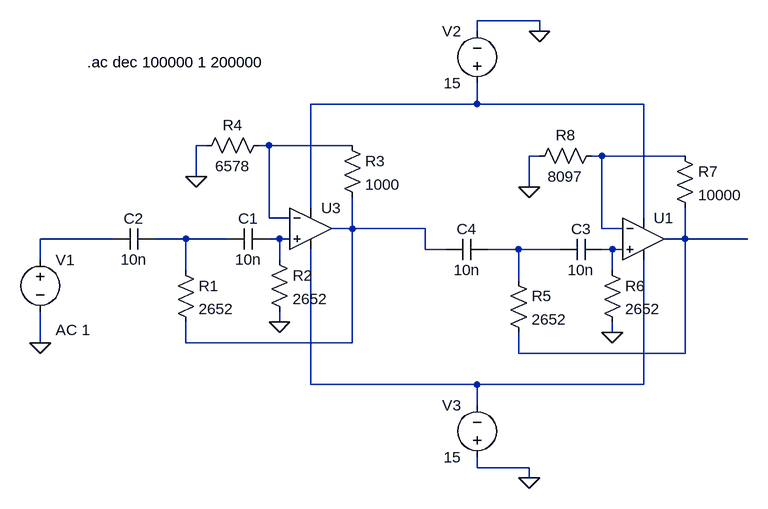
[diagram p0: schematic teste.asc]
teste.asc, the LTspice schematic file:
Version 4
SHEET 1 880 744
WIRE 128 -144 32 -144
WIRE 32 -128 32 -144
WIRE 128 -128 128 -144
WIRE 32 -16 32 -48
WIRE 32 -16 -224 -16
WIRE 288 -16 32 -16
WIRE -384 48 -400 48
WIRE -288 48 -304 48
WIRE -160 48 -288 48
WIRE 128 64 112 64
WIRE 224 64 208 64
WIRE 352 64 224 64
WIRE -400 96 -400 48
WIRE 112 112 112 64
WIRE -224 144 -224 -16
WIRE -288 160 -288 48
WIRE -256 160 -288 160
WIRE 288 160 288 -16
WIRE -160 176 -160 128
WIRE -160 176 -192 176
WIRE -48 176 -160 176
WIRE 224 176 224 64
WIRE 256 176 224 176
WIRE -528 192 -640 192
WIRE -416 192 -464 192
WIRE -352 192 -416 192
WIRE -272 192 -288 192
WIRE -256 192 -272 192
WIRE 352 192 352 144
WIRE 352 192 320 192
WIRE 448 192 352 192
WIRE -48 208 -48 176
WIRE -16 208 -48 208
WIRE 96 208 48 208
WIRE 160 208 96 208
WIRE 240 208 224 208
WIRE 256 208 240 208
WIRE -640 224 -640 192
WIRE -272 224 -272 192
WIRE -416 240 -416 192
WIRE 240 240 240 208
WIRE 96 256 96 208
WIRE -272 320 -272 304
WIRE 240 336 240 320
WIRE -640 352 -640 304
WIRE -416 352 -416 320
WIRE -160 352 -160 176
WIRE -160 352 -416 352
WIRE 96 368 96 336
WIRE 352 368 352 192
WIRE 352 368 96 368
WIRE -224 416 -224 208
WIRE 32 416 -224 416
WIRE 288 416 288 224
WIRE 288 416 32 416
WIRE 32 448 32 416
WIRE 32 544 32 528
WIRE 112 544 32 544
WIRE 112 560 112 544
FLAG -272 320 0
FLAG -400 96 0
FLAG 128 -128 0
FLAG 112 560 0
FLAG 240 336 0
FLAG 112 112 0
FLAG -640 352 0
SYMBOL Opamps\\UniversalOpamp2 -224 176 R0
SYMATTR InstName U3
SYMBOL cap -288 176 R90
WINDOW 0 0 32 VBottom 2
WINDOW 3 32 32 VTop 2
SYMATTR InstName C1
SYMATTR Value 10n
SYMBOL cap -464 176 R90
WINDOW 0 0 32 VBottom 2
WINDOW 3 32 32 VTop 2
SYMATTR InstName C2
SYMATTR Value 10n
SYMBOL res -432 224 R0
SYMATTR InstName R1
SYMATTR Value 2652
SYMBOL res -288 208 R0
SYMATTR InstName R2
SYMATTR Value 2652
SYMBOL res -176 32 R0
SYMATTR InstName R3
SYMATTR Value 1000
SYMBOL res -400 64 R270
WINDOW 0 32 56 VTop 2
WINDOW 3 0 56 VBottom 2
SYMATTR InstName R4
SYMATTR Value 6578
SYMBOL Opamps\\UniversalOpamp2 288 192 R0
SYMATTR InstName U1
SYMBOL cap 224 192 R90
WINDOW 0 0 32 VBottom 2
WINDOW 3 32 32 VTop 2
SYMATTR InstName C3
SYMATTR Value 10n
SYMBOL cap 48 192 R90
WINDOW 0 0 32 VBottom 2
WINDOW 3 32 32 VTop 2
SYMATTR InstName C4
SYMATTR Value 10n
SYMBOL res 80 240 R0
SYMATTR InstName R5
SYMATTR Value 2652
SYMBOL res 224 224 R0
SYMATTR InstName R6
SYMATTR Value 2652
SYMBOL res 336 48 R0
SYMATTR InstName R7
SYMATTR Value 10000
SYMBOL res 112 80 R270
WINDOW 0 32 56 VTop 2
WINDOW 3 0 56 VBottom 2
SYMATTR InstName R8
SYMATTR Value 8097
SYMBOL voltage -640 208 R0
WINDOW 123 24 124 Left 2
WINDOW 39 0 0 Left 2
SYMATTR Value2 AC 1
SYMATTR InstName V1
SYMATTR Value ""
SYMBOL voltage 32 -32 R180
WINDOW 0 24 96 Left 2
WINDOW 3 24 16 Left 2
WINDOW 123 0 0 Left 2
WINDOW 39 0 0 Left 2
SYMATTR InstName V2
SYMATTR Value 15
SYMBOL voltage 32 544 R180
WINDOW 0 24 96 Left 2
WINDOW 3 24 16 Left 2
WINDOW 123 0 0 Left 2
WINDOW 39 0 0 Left 2
SYMATTR InstName V3
SYMATTR Value 15
TEXT -568 -80 Left 2 !.ac dec 100000 1 200000

The netlist it stands for:
* teste.asc
XU3 N007 N002 N001 N011 N004 level.2 Avol=1Meg GBW=10Meg Slew=10Meg ilimit=25m rail=0 Vos=0 phimargin=45 en=0 enk=0 in=0 ink=0 Rin=500Meg  ; pins IN+ IN- V+ V- OUT
C1 N007 N006 10n
C2 N006 N005 10n
R1 N006 N004 2652
R2 N007 0 2652
R3 N002 N004 1000
R4 0 N002 6578
XU1 N010 N003 N001 N011 N008 level.2 Avol=1Meg GBW=10Meg Slew=10Meg ilimit=25m rail=0 Vos=0 phimargin=45 en=0 enk=0 in=0 ink=0 Rin=500Meg  ; pins IN+ IN- V+ V- OUT
C3 N010 N009 10n
C4 N009 N004 10n
R5 N009 N008 2652
R6 N010 0 2652
R7 N003 N008 10000
R8 0 N003 8097
V1 N005 0 AC 1
V2 N001 0 15
V3 0 N011 15
.ac dec 100000 1 200000
.lib UniversalOpamps2.sub
.backanno
.end